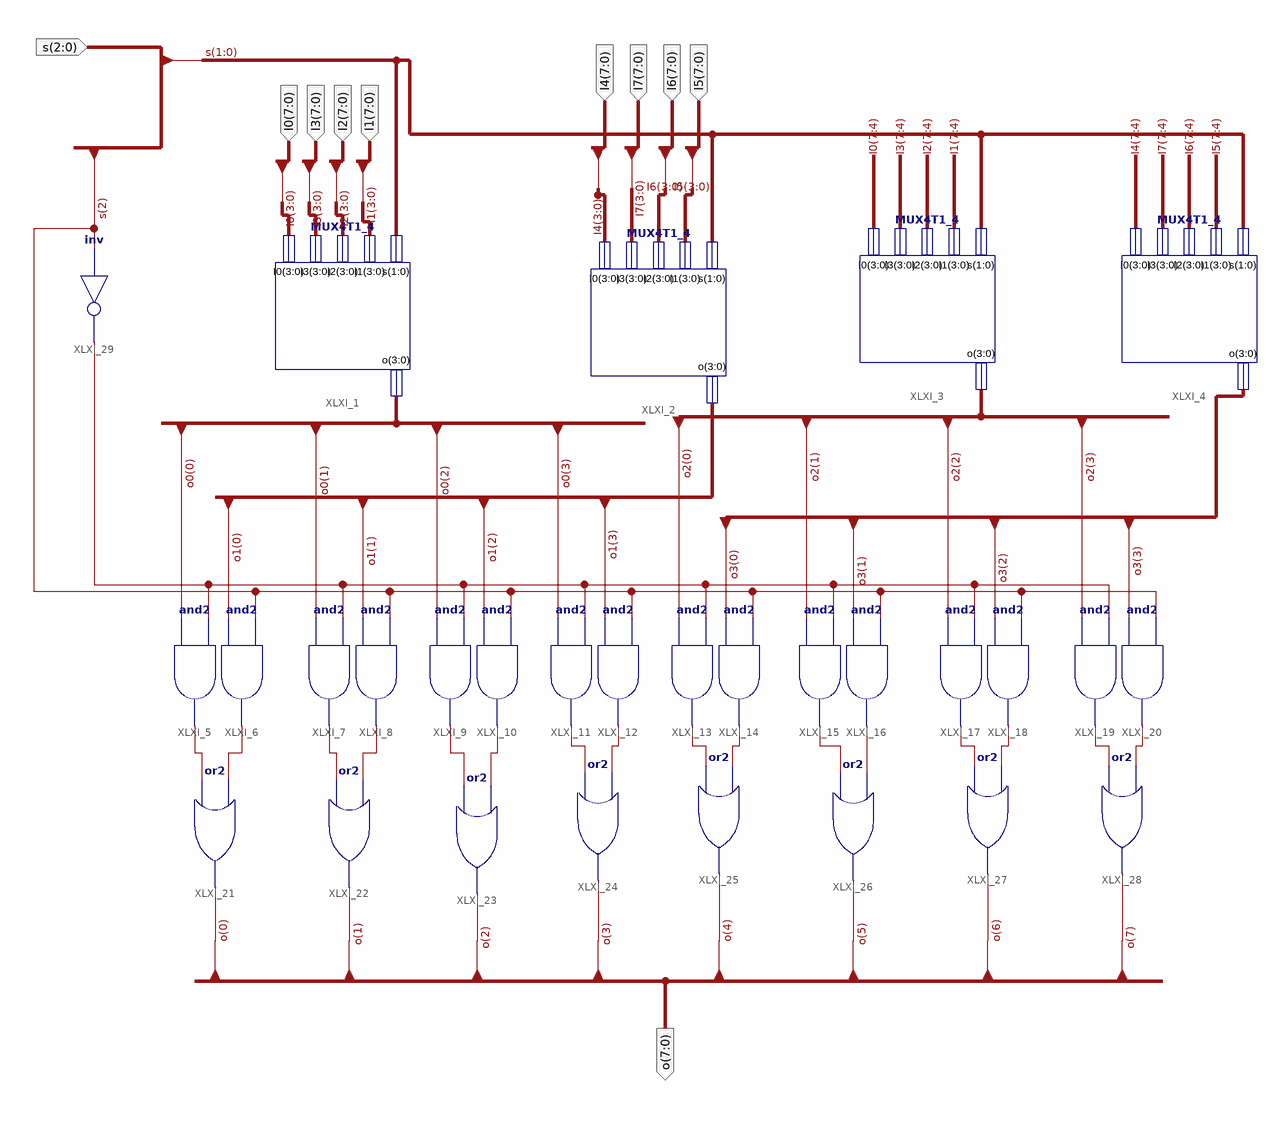
[diagram p0: schematic sheet 1]
// Xilinx ISE schematic MUX8T1_8.sch (kintex7) as structural Verilog: 29 symbols, 10 ports
module MUX8T1_8 (
  input  [7:0] I0,
  input  [7:0] I3,
  input  [7:0] I2,
  input  [7:0] I1,
  input  [7:0] I4,
  input  [7:0] I7,
  input  [7:0] I6,
  input  [7:0] I5,
  input  [2:0] s,
  output [7:0] o
);

  wire XLXN_66, XLXN_67, XLXN_68, XLXN_69, XLXN_70, XLXN_71, XLXN_72, XLXN_73, XLXN_74, XLXN_75, XLXN_76,
       XLXN_77, XLXN_78, XLXN_79, XLXN_80, XLXN_81, XLXN_89;
  wire [3:0] o0, o1, o2, o3;

  MUX4T1_4 XLXI_1 (.s(s[1:0]), .I1(I1[3:0]), .I2(I2[3:0]), .I3(I3[3:0]), .I0(I0[3:0]), .o(o0));
  MUX4T1_4 XLXI_2 (.s(s[1:0]), .I1(I5[3:0]), .I2(I6[3:0]), .I3(I7[3:0]), .I0(I4[3:0]), .o(o1));
  MUX4T1_4 XLXI_3 (.s(s[1:0]), .I1(I1[7:4]), .I2(I2[7:4]), .I3(I3[7:4]), .I0(I0[7:4]), .o(o2));
  MUX4T1_4 XLXI_4 (.s(s[1:0]), .I1(I5[7:4]), .I2(I6[7:4]), .I3(I7[7:4]), .I0(I4[7:4]), .o(o3));
  and XLXI_5 (XLXN_66, o0[0], XLXN_89);
  and XLXI_6 (XLXN_67, o1[0], s[2]);
  and XLXI_7 (XLXN_68, o0[1], XLXN_89);
  and XLXI_8 (XLXN_69, o1[1], s[2]);
  and XLXI_9 (XLXN_70, o0[2], XLXN_89);
  and XLXI_10 (XLXN_71, o1[2], s[2]);
  and XLXI_11 (XLXN_72, o0[3], XLXN_89);
  and XLXI_12 (XLXN_73, o1[3], s[2]);
  and XLXI_13 (XLXN_74, o2[0], XLXN_89);
  and XLXI_14 (XLXN_75, o3[0], s[2]);
  and XLXI_15 (XLXN_76, o2[1], XLXN_89);
  and XLXI_16 (XLXN_77, o3[1], s[2]);
  and XLXI_17 (XLXN_78, o2[2], XLXN_89);
  and XLXI_18 (XLXN_79, o3[2], s[2]);
  and XLXI_19 (XLXN_80, o2[3], XLXN_89);
  and XLXI_20 (XLXN_81, o3[3], s[2]);
  or XLXI_21 (o[0], XLXN_66, XLXN_67);
  or XLXI_22 (o[1], XLXN_68, XLXN_69);
  or XLXI_23 (o[2], XLXN_70, XLXN_71);
  or XLXI_24 (o[3], XLXN_72, XLXN_73);
  or XLXI_25 (o[4], XLXN_74, XLXN_75);
  or XLXI_26 (o[5], XLXN_76, XLXN_77);
  or XLXI_27 (o[6], XLXN_78, XLXN_79);
  or XLXI_28 (o[7], XLXN_80, XLXN_81);
  not XLXI_29 (XLXN_89, s[2]);
endmodule
